# Altium schematic sheet All.SchDoc
size A4; SheetNumber: 1; SheetTotal: 7
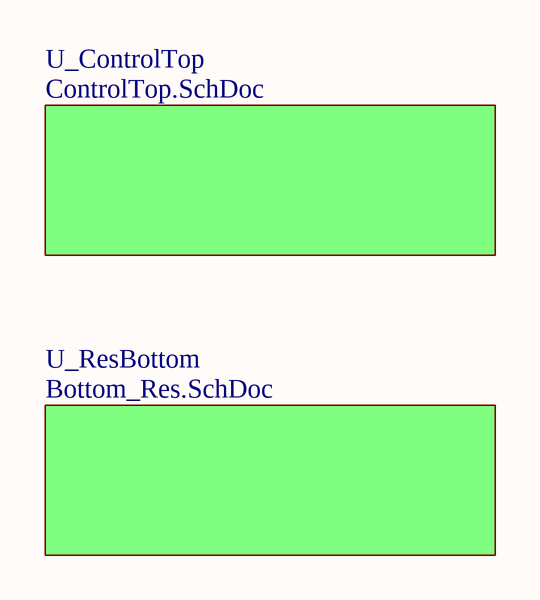
[diagram p0: All.SchDoc]

## Sub-sheets
U_ControlTop = ControlTop.SchDoc: no entries
U_ResBottom = Bottom_Res.SchDoc: no entries